# Altium schematic sheet USB Interface.SchDoc
size 431 x 279 mm; Organization: ORGANIZATION; Address1: ADDRESS 1; Address2: ADDRESS 2; Address3: ADDRESS 3; Address4: ADDRESS 4; Revision: -; SheetNumber: 4; SheetTotal: 6; ENG_APP_DATE: --/--/--; DSN_APP_DATE: --/--/--; CHK_APP_DATE: --/--/--
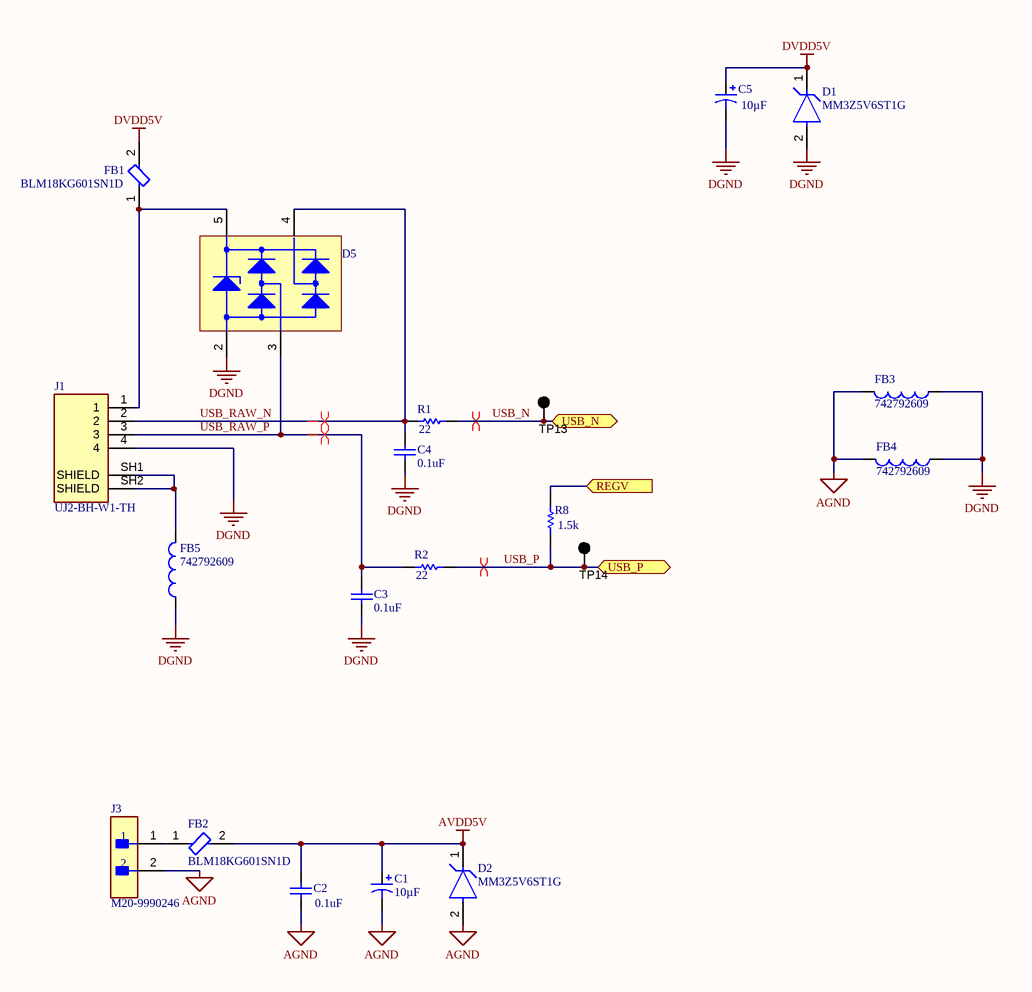
[diagram p0: USB Interface.SchDoc]

## Parts
C1  10µF  [1206 TANT CASE A]
C2  0.1uF  [0603]
C3  0.1uF  [0603]
C4  0.1uF  [0603]
C5  10µF  [1206 TANT CASE A]
D1  MM3Z5V6ST1G  [FP-477-02-MFG]
D2  MM3Z5V6ST1G  [FP-477-02-MFG]
D5  5V  [WE-TVS_SOT23-5L]  (value not drawn)
FB1  BLM18KG601SN1D  [FP-BLM18-0_15-t0_8-IPC_A]
FB2  BLM18KG601SN1D  [FP-BLM18-0_15-t0_8-IPC_A]
FB3  742792609  [WE-CBF_0603_L1.6W0.8H0.8_HC]
FB4  742792609  [WE-CBF_0603_L1.6W0.8H0.8_HC]
FB5  742792609  [WE-CBF_0603_L1.6W0.8H0.8_HC]
J1  UJ2-BH-W1-TH  [CUI_UJ2-BH-W1-TH]
J3  M20-9990246  [FP-M20-9990246-MFG]
R1  22  [0603]
R2  22  [0603]
R8  1.5k  [0603]
TP13  5001  [Testpoint pad]  (value not drawn)
TP14  5001  [Testpoint pad]  (value not drawn)

## Ports
REGV (in, see Top Level[7E], CM6206[7D]), USB_N (bidir, see Top Level[7E], CM6206[7D]), USB_P (bidir, see Top Level[7E], CM6206[7D])

## Nets
AGND: C1.1 C2.1 D2.2(A) FB3.2 FB4.2 J3.2
AVDD5V: C1.2 C2.2 D2.1(C) FB2.2
DGND: C3.1 C4.1 C5.1 D1.2(A) D5.2(GND) FB3.1 FB4.1 FB5.1 J1.4
DVDD5V: C5.2 D1.1(C) FB1.2
REGV: R8.1 ; port REGV
USB_N: R1.2 TP13.1 ; port USB_N
USB_P: R2.2 R8.2 TP14.1 ; port USB_P
USB_RAW_N: C4.2 D5.4(I/O_2) J1.2 R1.1
USB_RAW_P: C3.2 D5.3(I/O_1) J1.3 R2.1
NetD5_5: D5.5(VDD) FB1.1 J1.1
NetFB2_1: FB2.1 J3.1
NetFB5_2: FB5.2 J1.SH1(SHIELD) J1.SH2(SHIELD)

## Layout directives
differential pair: USB_N, USB_P, USB_RAW_N, USB_RAW_P

## Notes on the sheet
- DWG. NO.
- REV.
- SHT.
- THIS DOCUMENT AND THE DATA DISCLOSED HEREIN OR HEREWITH IS THE PROPERTY OF ALTIUM LIMITED AND MAY BE FREELY DISTRIBUTED IN WHOLE. NO RIGHTS ARE RESERVED OR EXPRESS OR IMPLIED WARANTEE GIVEN.
- REVISION
- DESCRIPTION
- DATE
- APPROVED
- ENG:
- APPROVALS
- PROJECT
- DSN:
- CHK:
- REFERENCE DOCUMENTS
- PROJECT REVISION:
- TITLE
- DOCUMENT REVISION:
- DESIGN ITEM:
- BOM:
- FAB DWG:
- PCB DWG:
- ASSY DWG:
- SCALE:
- SIZE
- B
- CAGE CODE
- FILE NAME
- DWG NO.
- SHEET
- OF
- REV

## Library data of the parts
C1 C5 = T491A106M016AT: CAP TANT 10UF 16V 20% 1206; Manufacturer Size Code: A; Manufacturer: Kemet; ESR (Equivalent Series Resistance): 7 Ohm; Type: Molded; Lifetime @ Temp.: 2000 Hrs @ 85°C; Packaging: Cut Tape (CT); Capacitance: 10µF; Tolerance: ±20%; Voltage - Rated: 16V; Operating Temperature: -55°C ~ 125°C; Mounting Type: Surface Mount; Package / Case: 1206 (3216 Metric); Size / Dimension: 0.126" L x 0.063" W (3.20mm x 1.60mm); Height - Seated (Max): 0.071" (1.80mm); Lead Spacing: -; Features: General Purpose; ComponentLink1URL: http://www.kemet.com/Lists/ProductCatalog/Attachments/254/KEM_T2005_T491.pdf; ComponentLink1Description: http://www.kemet.com/Lists/ProductCatalog/Attachments/254/KEM_T2005_T491.pdf; Supplier 1: Digi-Key; Supplier Part Number 1: 399-3687-1-ND; Manufacturer Part Number: T491A106M016AT; RoHS: RoHS Compliant; Category: Capacitors; Stock: 136950; Pricing: 1=0.41, 10=0.362, 50=0.2198, 100=0.181, 250=0.14476, 500=0.13184, 1000=0.11891 (USD)
C2-C4 = C TBD 0603
D1 D2 = CMP-1060-00706-2: DIODE ZENER 5.6V 300MW SOD323; Test Current: 5mA; Power Rating: 200mW; ESD Protection: Yes; Peak Reverse Current: 1uA; Voltage Tolerance: 2%; Forward Voltage: 900mV; Impedance: 40R; Element Configuration: Single; Material: Plastic; Zener Current: 10mA; Length: 1.8mm; Package Quantity: 1; Contact Plating: Tin; Number of Pins: 2; Case/Package: SOD-323-2; Max Power Dissipation: 200mW; Lead Free: Lead Free; Radiation Hardening: No; Width: 1.35mm; REACH SVHC: No SVHC; Zener Voltage: 5.6V; Height: 1mm; Max Reverse Leakage Current: 1uA; Packaging: Tape and Reel; Min Operating Temperature: -65°C; Voltage Rating (DC): 5.6V; Power Dissipation: 200mW; Max Operating Temperature: 150°C; Working Voltage: 5.6V; Tolerance: 2%
D5 = 824011: WE-TVS TVS Diode – High Speed Series, SOT23-5L, 2+1 Channel, 5V, 2pF; Manufacturer: Wurth Elektronik; Channel ESD Clamping Voltage: 13V; Channel Reverse Leakage Current: 1uA; ESD Air Discharge Capability: 24kV; ESD Contact Discharge Capability: 16kV; Polarity: Unidirectional; (Reverse) Breakdown Voltage: 6.1V; (Reverse) Peak Pulse Current: 13A; Manufacturer Part Number: 824011; Category: ESD Protection; Match Code: WE-TVS; ComponentLink1Description: Website Link; ComponentLink1URL: https://www.we-online.com/redexpert/article/824011?ad; ComponentLink2Description: Datasheet Link; ComponentLink2URL: https://www.we-online.com/redexpert/spec/824011?ad; Mount: Surface Mount; Operating Temperature Max: 125°C; Operating Temperature Min: -55°C; Packaging: Tape and Reel; Case/Size Code: SOT23-5L; Length: 2.9mm; Width: 2.8mm; Height: 1.16mm; Channel Input Capacitance: 2pF; Channel Operating Voltage: 5V; Number of Channels: 2+1
FB1 FB2 = CMP-0686-00581-3: Chip Ferrite Bead, 0603, 600Ω @ 100MHz, 0.15Ω, 25%, 1.3A; Material: Steel; Number of Lines: 1; Impedance: 600R; DC Resistance (DCR): 150mR; Tolerance: 25%; Case Code (Metric): 1608; Width: 0.8mm; DC Current: 1.3A; Max DC Current: 1.3A; Package Quantity: 1; Number of Pins: 2; Military Standard: Not; RoHS Compliant: Yes; Termination: SMD/SMT; Max Operating Temperature: 125°C; Length: 1.6mm; Depth: 0.8mm; Case Code (Imperial): 0603; Series: BLM18K; Inductor Type: FERRITE BEAD; Core Material: Ferrite; Number of Circuits: 1; Height: 0.8mm; Case/Package: 0603; REACH SVHC: No SVHC; Packaging: Tape and Reel; Min Operating Temperature: -55°C; Max Current Rating: 1.3A; Radiation Hardening: No; Current Rating: 1.3A; Lead Free: Lead Free; Test Frequency: 100MHz; Weight: 7.1E-05oz
FB3-FB5 = CMP-0220-00193-3: NexarPartId: 8916973; Series Resistance: 40mΩ; RMS Current (Irms): 3A; Number of Lines: 1; Tolerance: 25%; Inductance: 5.6H; Test Frequency: 100MHz; Impedance: 30Ω; Max Operating Temperature: 125°C; Termination: SMD/SMT; Length: 1.6mm; Mount: Surface Mount; Case/Package: SMD/SMT; REACH SVHC: Unknown; Max DC Current: 3A; DC Resistance (DCR): 40mΩ; Resistance: 40mΩ; Min Operating Temperature: -55°C; Max Current Rating: 3A; Case Code (Metric): 1608; Width: 800µm; Material: Ferrite; Current Rating: 3A; Core Material: Ferrite; Packaging: Digi-Reel®; Height: 800µm; RoHS: Compliant; Depth: 800µm; Weight: 3.997283mg; Case Code (Imperial): 0603
J1 = UJ2-BH-W1-TH: 3 µin Plating Thickness, White Insulator, USB Receptacle; MF: {'manufacturer': u'CUI'}; Price: None; Value: *; Package: None; Availability: Unavailable; MP: UJ2-BH-W1-TH
J3 = CMP-15831-000009-1: CONN HEADER VERT 2POS 2.54MM; Manufacturer: Harwin; Conn Gender: Male; Conn Orientation: Vertical; Number Of Contacts: 2; Current Rating: 3A; ComponentLink2URL: https://cdn.harwin.com/pdfs/M20-999.pdf; ComponentLink2Description: Datasheet; Package: M20-9990246; Temperature: -40°C to +105°C; Octopart: https://octopart.com/m20-9990246-harwin-2590635; Mouser Description: 2.54mm (0.1") Pitch SIL Vertical PC Tail Pin Header, 6.1mm mating pin height, tin, 2 contacts; Temperature Range High: +105°C; Device Class L1: Connectors; RoHS: TRUE; Automotive: No; Height: 8.99mm; Number Of Rows: 1; Contact Material: Tin,Nickel; Category: Conn; Pitch: 2.54mm; Lead Free: Yes; Digikey Description: CONN HEADER VERT 2POS 2.54MM; Manufacturer Part Number: M20-9990246; Temperature Range Low: -40°C; Device Class L3: unset; Device Class L2: Headers and Wire Housings
R1 R2 R8 = R TBD 0603
TP13 TP14 = 5001: TEST POINT PC MINI .040"D BLACK; Manufacturer: Keystone Electronics; Packaging: Bulk; Type: PC Test Point, Miniature; Terminal: 0.010" x 0.020" (0.25mm x 0.51mm) Phosphor Bronze Wire, Silver Plated; Mounting Type: 0.040" (1.02mm) Hole Diameter; Material: Base, Nylon 46, UL 94V-0; Color: Black; ComponentLink1URL: http://www.keyelco.com/product-pdf.cfm?p=1310; ComponentLink1Description: http://www.keyelco.com/product-pdf.cfm?p=1310; Supplier 1: Digi-Key; Supplier Part Number 1: 36-5001-ND; Manufacturer Part Number: 5001; RoHS: RoHS Compliant; Category: Test and Measurement; Stock: 443864; Pricing: 1=0.36, 10=0.327, 50=0.238, 100=0.2286, 250=0.20528, 500=0.19594, 1000=0.16328, 2500=0.14928, 5000=0.13995 (USD)